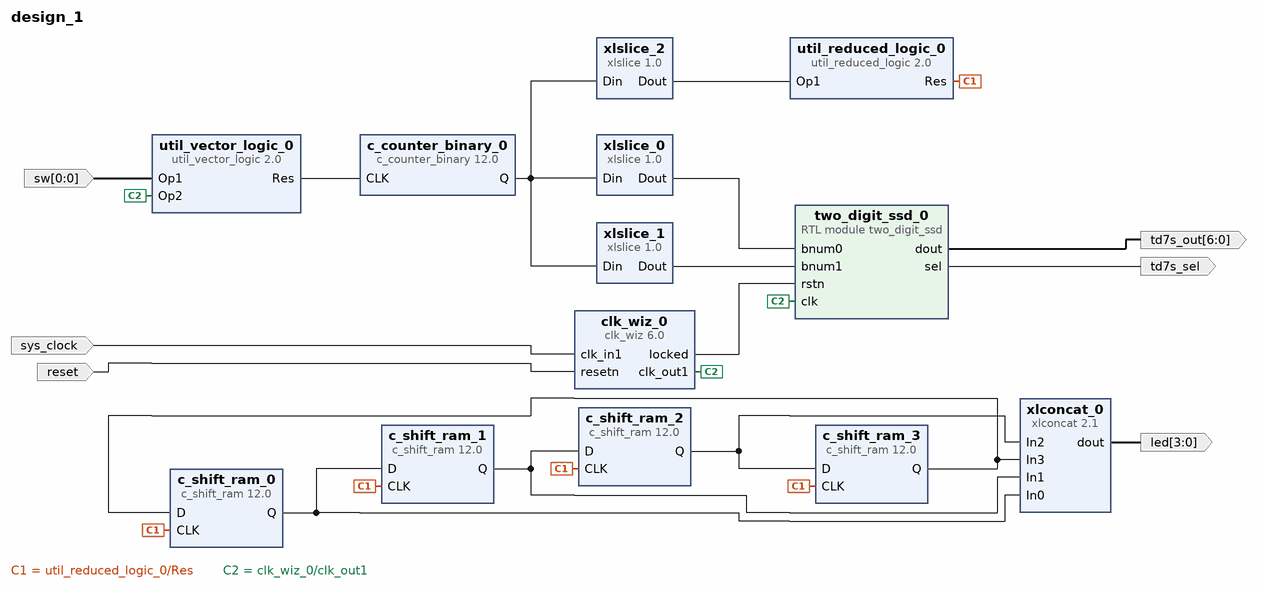
[diagram p0: block diagram of the top level]
# Vivado block design design_1, xc7a35ticsg324-1L, Vivado 2020.2
create_bd_design design_1

create_bd_port -dir I -type clk sys_clock
set_property -dict {CONFIG.ASSOCIATED_RESET reset CONFIG.FREQ_HZ 100000000 CONFIG.PHASE 0.000} [get_bd_ports sys_clock]
create_bd_port -dir O -type data td7s_sel
create_bd_port -dir O -from 6 -to 0 -type data td7s_out
create_bd_port -dir I -type rst reset
set_property -dict {CONFIG.POLARITY ACTIVE_LOW} [get_bd_ports reset]
create_bd_port -dir O -from 3 -to 0 -type data led
create_bd_port -dir I -from 0 -to 0 -type data sw

create_bd_cell -type module -reference two_digit_ssd two_digit_ssd_0
create_bd_cell -type ip -vlnv xilinx.com:ip:c_counter_binary:12.0 c_counter_binary_0
set_property -dict {CONFIG.Output_Width 32 CONFIG.SSET false} [get_bd_cells c_counter_binary_0]
create_bd_cell -type ip -vlnv xilinx.com:ip:xlslice:1.0 xlslice_0
set_property -dict {CONFIG.DIN_FROM 27 CONFIG.DIN_TO 24 CONFIG.DIN_WIDTH 32 CONFIG.DOUT_WIDTH 4} [get_bd_cells xlslice_0]
create_bd_cell -type ip -vlnv xilinx.com:ip:xlslice:1.0 xlslice_1
set_property -dict {CONFIG.DIN_FROM 31 CONFIG.DIN_TO 28 CONFIG.DIN_WIDTH 32 CONFIG.DOUT_WIDTH 4} [get_bd_cells xlslice_1]
create_bd_cell -type ip -vlnv xilinx.com:ip:clk_wiz:6.0 clk_wiz_0
set_property -dict [list \
  CONFIG.CLKOUT1_REQUESTED_OUT_FREQ 100 \
  CONFIG.CLK_IN1_BOARD_INTERFACE sys_clock \
  CONFIG.RESET_BOARD_INTERFACE reset \
  CONFIG.RESET_PORT resetn \
  CONFIG.RESET_TYPE ACTIVE_LOW \
  CONFIG.USE_BOARD_FLOW true \
  CONFIG.USE_POWER_DOWN false \
] [get_bd_cells clk_wiz_0]
create_bd_cell -type ip -vlnv xilinx.com:ip:xlconcat:2.1 xlconcat_0
set_property -dict [list \
  CONFIG.IN0_WIDTH 1 \
  CONFIG.IN1_WIDTH 1 \
  CONFIG.IN2_WIDTH 1 \
  CONFIG.IN3_WIDTH 1 \
  CONFIG.NUM_PORTS 4 \
] [get_bd_cells xlconcat_0]
create_bd_cell -type ip -vlnv xilinx.com:ip:c_shift_ram:12.0 c_shift_ram_3
set_property -dict {CONFIG.AsyncInitVal 0 CONFIG.DefaultData 0 CONFIG.Depth 1 CONFIG.Width 1} [get_bd_cells c_shift_ram_3]
create_bd_cell -type ip -vlnv xilinx.com:ip:c_shift_ram:12.0 c_shift_ram_2
set_property -dict {CONFIG.AsyncInitVal 0 CONFIG.DefaultData 0 CONFIG.Depth 1 CONFIG.Width 1} [get_bd_cells c_shift_ram_2]
create_bd_cell -type ip -vlnv xilinx.com:ip:c_shift_ram:12.0 c_shift_ram_0
set_property -dict {CONFIG.AsyncInitVal 1 CONFIG.DefaultData 0 CONFIG.Depth 1 CONFIG.Width 1} [get_bd_cells c_shift_ram_0]
create_bd_cell -type ip -vlnv xilinx.com:ip:c_shift_ram:12.0 c_shift_ram_1
set_property -dict {CONFIG.AsyncInitVal 0 CONFIG.DefaultData 0 CONFIG.Depth 1 CONFIG.Width 1} [get_bd_cells c_shift_ram_1]
create_bd_cell -type ip -vlnv xilinx.com:ip:util_reduced_logic:2.0 util_reduced_logic_0
set_property -dict {CONFIG.C_OPERATION or CONFIG.C_SIZE 1} [get_bd_cells util_reduced_logic_0]
create_bd_cell -type ip -vlnv xilinx.com:ip:xlslice:1.0 xlslice_2
set_property -dict {CONFIG.DIN_FROM 26 CONFIG.DIN_TO 26 CONFIG.DOUT_WIDTH 1} [get_bd_cells xlslice_2]
create_bd_cell -type ip -vlnv xilinx.com:ip:util_vector_logic:2.0 util_vector_logic_0
set_property -dict {CONFIG.C_SIZE 1} [get_bd_cells util_vector_logic_0]

# ---- connections ----

connect_bd_net [get_bd_pins c_counter_binary_0/Q] [get_bd_pins xlslice_0/Din] [get_bd_pins xlslice_1/Din] [get_bd_pins xlslice_2/Din]
connect_bd_net [get_bd_ports sys_clock] [get_bd_pins clk_wiz_0/clk_in1]
connect_bd_net [get_bd_pins clk_wiz_0/locked] [get_bd_pins two_digit_ssd_0/rstn]
connect_bd_net [get_bd_pins two_digit_ssd_0/sel] [get_bd_ports td7s_sel]
connect_bd_net [get_bd_pins two_digit_ssd_0/dout] [get_bd_ports td7s_out]
connect_bd_net [get_bd_ports reset] [get_bd_pins clk_wiz_0/resetn]
connect_bd_net [get_bd_pins xlslice_0/Dout] [get_bd_pins two_digit_ssd_0/bnum0]
connect_bd_net [get_bd_pins xlslice_1/Dout] [get_bd_pins two_digit_ssd_0/bnum1]
connect_bd_net [get_bd_pins c_shift_ram_3/Q] [get_bd_pins xlconcat_0/In3] [get_bd_pins c_shift_ram_0/D]
connect_bd_net [get_bd_pins c_shift_ram_2/Q] [get_bd_pins c_shift_ram_3/D] [get_bd_pins xlconcat_0/In2]
connect_bd_net [get_bd_pins c_shift_ram_1/Q] [get_bd_pins c_shift_ram_2/D] [get_bd_pins xlconcat_0/In1]
connect_bd_net [get_bd_pins c_shift_ram_0/Q] [get_bd_pins xlconcat_0/In0] [get_bd_pins c_shift_ram_1/D]
connect_bd_net [get_bd_pins xlconcat_0/dout] [get_bd_ports led]
connect_bd_net [get_bd_pins util_reduced_logic_0/Res] \
  [get_bd_pins c_shift_ram_1/CLK] [get_bd_pins c_shift_ram_2/CLK] [get_bd_pins c_shift_ram_0/CLK] \
  [get_bd_pins c_shift_ram_3/CLK]
connect_bd_net [get_bd_pins xlslice_2/Dout] [get_bd_pins util_reduced_logic_0/Op1]
connect_bd_net [get_bd_ports sw] [get_bd_pins util_vector_logic_0/Op1]
connect_bd_net [get_bd_pins util_vector_logic_0/Res] [get_bd_pins c_counter_binary_0/CLK]
connect_bd_net [get_bd_pins clk_wiz_0/clk_out1] [get_bd_pins util_vector_logic_0/Op2] [get_bd_pins two_digit_ssd_0/clk]

validate_bd_design
save_bd_design
